# Altium schematic sheet Igul-418-T8.SchDoc: "Igul-418-T8"
size 420 x 297 mm; DrawnBy: Lazarev V; SheetNumber: 1; SheetTotal: 2; PageSetup: Record=PageOptions|CenterHorizontal=True|CenterVertical=True|PrintScale=0.75|XCorrection=1.00|YCorrection=1.00|PrintKind=0|BorderSize=5000000|LeftOffset=0|BottomOffset=0|Orientation=2|PaperLength=1000|PaperWidth=1000|Scale=100|PaperSource=260|PrintQuality=600|MediaType=1|DitherType=10|PaperKind=Letter|PrintScaleMode=1; DocumentName: Sheet1.SCHDOC
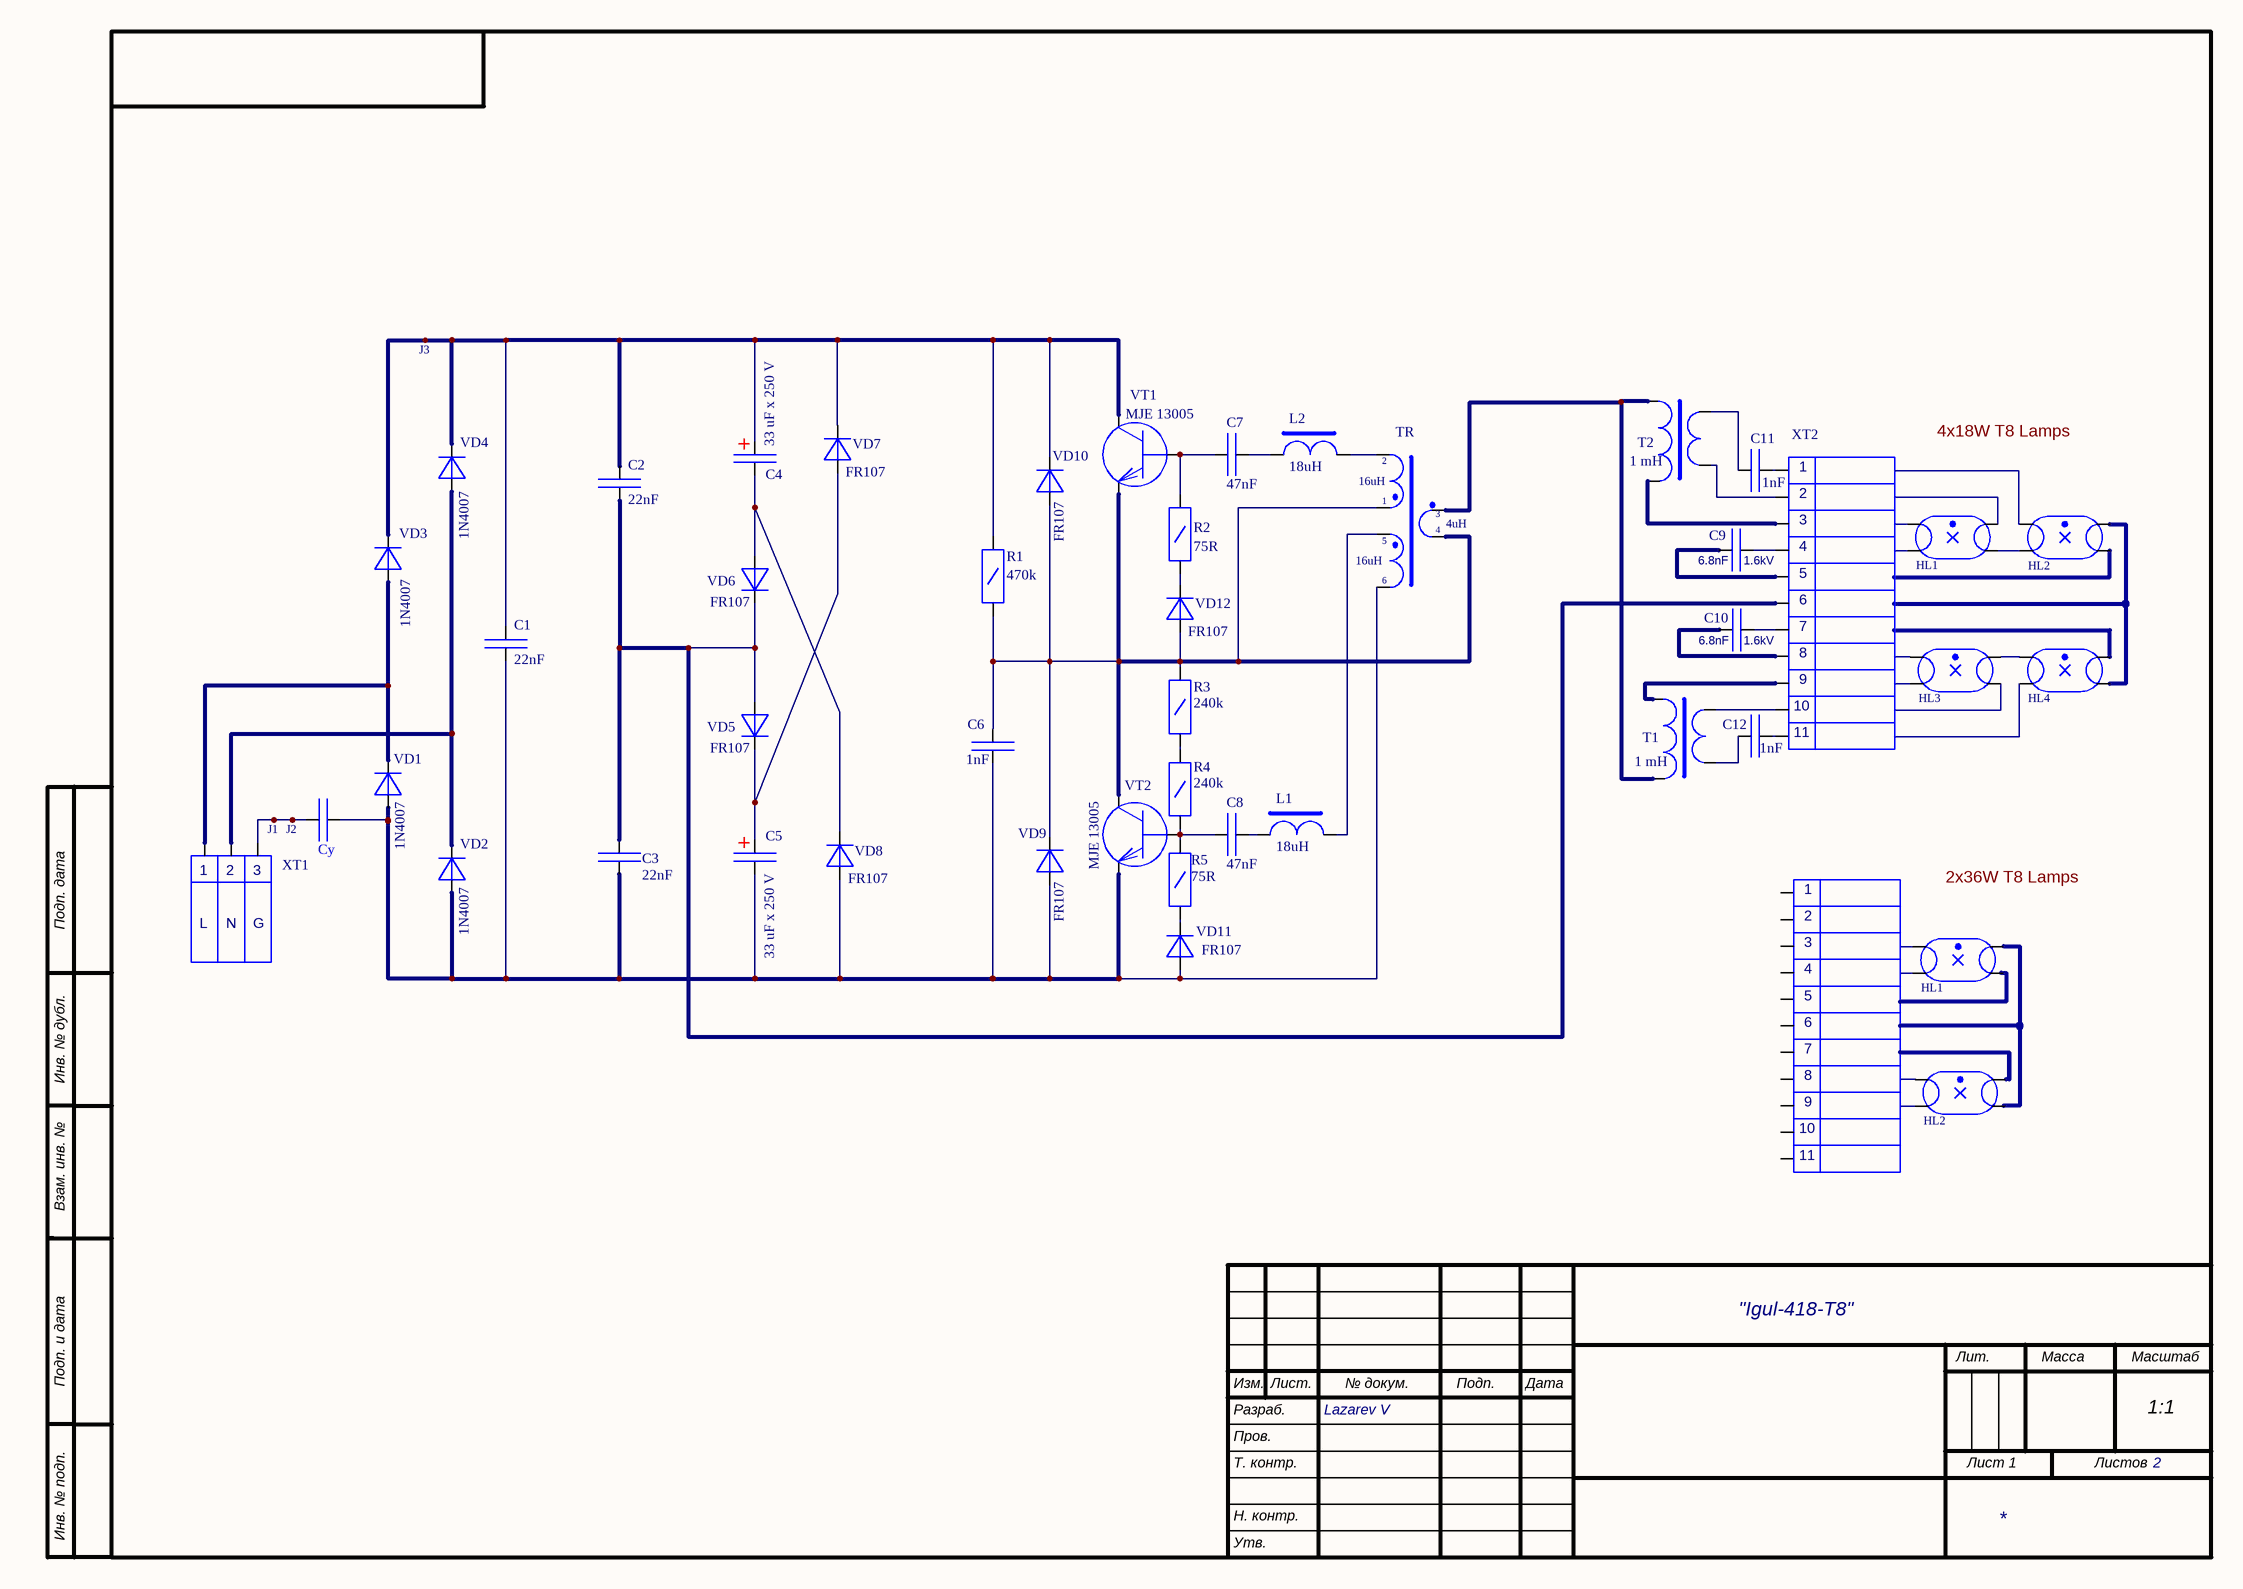
[diagram p0: Igul-418-T8.SchDoc]

## Parts
(Parts that share a designator on the sheet are numbered #1, #2 ... from top to bottom, then left to right.)
C1  value 22nF  [CAPR5.0x13.0-7.5/10]  (hidden comment: Comment)
C2  value 22nF  [CAPR5.0x13.0-7.5/10]  (hidden comment: Comment)
C3  value 22nF  [CAPR5.0x13.0-7.5/10]  (hidden comment: Comment)
C4  value 33 uF x 250 V  [CAPR E 12.5x20, pitch 5mm]  (hidden comment: 33mkF)
C5  value 33 uF x 250 V  [CAPR E 12.5x20, pitch 5mm]  (hidden comment: 33mkF)
C6  value 1nF  [CAPR5.0x13.0-5.0]  (hidden comment: Comment)
C7  value 47nF  [CAPR5.0x2.5-5.0 P. Disk]  (hidden comment: Comment)
C8  value 47nF  [CAPR5.0x2.5-5.0 P. Disk]  (hidden comment: Comment)
C9  value 6.8nF  Voltage: 1.6kV  [CAPR5.0x13.0-7.5]  (hidden comment: Comment)
C10  value 6.8nF  Voltage: 1.6kV  [CAPR5.0x13.0-7.5]  (hidden comment: Comment)
C11  value 1nF  [CAPR5.0x13.0-5.0]  (hidden comment: Comment)
C12  value 1nF  [CAPR5.0x13.0-5.0]  (hidden comment: Comment)
Cy  Comment  [CAPR Y - 7.5]  (value not drawn)
HL1#1  Lamp Lum  (value not drawn)  (graphical)
HL1#2  Lamp Lum  (value not drawn)  (graphical)
HL2#1  Lamp Lum  (value not drawn)  (graphical)
HL2#2  Lamp Lum  (value not drawn)  (graphical)
HL3  Lamp Lum  (value not drawn)  (graphical)
HL4  Lamp Lum  (value not drawn)  (graphical)
J1  Comment  [AXIAL- Jumper_9.5mm]  (value not drawn)  (net tie, no BOM)
J2  Comment  [AXIAL- Jumper_9.5mm]  (value not drawn)  (net tie, no BOM)
J3  Comment  [AXIAL- Jumper_9.5mm]  (value not drawn)  (net tie, no BOM)
L1  value 18uH  [AXIAL Inductor - 0.4]  (hidden comment: Comment)
L2  value 18uH  [AXIAL Inductor - 0.4]  (hidden comment: Comment)
R1  value 470k  [RES10.0-1/4W-470k]  (hidden comment: Comment)
R2  value 75R  [RESC3216(1206)N]  (hidden comment: Comment)
R3  value 240k  [RESC3216(1206)N]  (hidden comment: Comment)
R4  value 240k  [RESC3216(1206)N]  (hidden comment: Comment)
R5  value 75R  [RESC3216(1206)N]  (hidden comment: Comment)
T1  Value2: 1 mH  [TKM-E20-1mH-1gH]  (hidden comment: TKM-E20-1mH-1gH)
T2  Value2: 1 mH  [TKM-E20-1mH-1gH]  (hidden comment: TKM-E20-1mH-1gH)
TR  Comment  [TKM-TR9-16uH]  (value not drawn)
VD1  value 1N4007  [CD4532-1812 (mod)]
VD2  value 1N4007  [CD4532-1812 (mod)]
VD3  value 1N4007  [CD4532-1812 (mod)]  (hidden comment: Diode HS1x)
VD4  value 1N4007  [CD4532-1812 (mod)]
VD5  value FR107  [DIODE-0.4]
VD6  value FR107  [DIODE-0.4]
VD7  value FR107  [DIODE-0.4]
VD8  value FR107  [DIODE-0.4]
VD9  value FR107  [DIODE-0.4]
VD10  value FR107  [DIODE-0.4]
VD11  value FR107  [DIODE-0.4 - TKM_SILK]  (hidden comment: Comment)
VD12  value FR107  [DIODE-0.4 - TKM_SILK]  (hidden comment: Comment)
VT1  value MJE 13005  [TO-220-AB]
VT2  value MJE 13005  [TO-220-AB]
XT1  Connect x3  [ZIP-Ballast3]  (value not drawn)
XT2  Comment  [ZIP-Ballast11]  (value not drawn)
XT?  Connect x11  [ZIP-Ballast11]  (value not drawn)  (graphical)

## Nets
NetC1_1: C1.1 C2.1 C4.1 J3.1(W*) R1.2 VD3.2 VD4.2 VD7.2 VD10.2 VT1.2(C)
NetC1_2: C1.2 C3.1 C5.2 C6.1 Cy.2 TR.6(Sec2+) VD1.1 VD2.1 VD8.1 VD9.1 VD11.1 VT2.3(E)
NetC2_2: C2.2 C3.2 VD5.1 VD6.2 XT2.6(6a)
NetC4_2: C4.2 VD6.1 VD8.2
NetC5_1: C5.1 VD5.2 VD7.1
NetC6_2: C6.2 R1.1 R3.1 TR.1(Sec1-) TR.4(Pri+) VD9.2 VD10.1 VD12.1 VT1.3(E) VT2.2(C)
NetC7_1: C7.1 R2.1 VT1.1(B)
NetC7_2: C7.2 L2.1(Pri+)
NetC8_1: C8.1 R4.2 R5.1 VT2.1(B)
NetC8_2: C8.2 L1.1(Pri+)
NetC9_1: C9.1 XT2.7(7a)
NetC9_2: C9.2 XT2.8(8a)
NetC10_1: C10.1 XT2.4(4a)
NetC10_2: C10.2 XT2.5(5a)
NetC11_1: C11.1 XT2.11(11a)
NetC11_2: C11.2 T2.8(Sec+)
NetC12_1: C12.1 XT2.1(1a)
NetC12_2: C12.2 T1.1(Sec-)
NetCy_1: Cy.1 J1.1(W*) J2.1(W*) XT1.3
NetL1_2: L1.2(Pri-) TR.5(Sec2-)
NetL2_2: L2.2(Pri-) TR.2(Sec1+)
NetR2_2: R2.2 VD12.2
NetR3_2: R3.2 R4.1
NetR5_2: R5.2 VD11.2
NetT1_4: T1.4(Pri+) XT2.3(3a)
NetT1_6: T1.6(Pri-) T2.4(Pri+) TR.3(Pri-)
NetT1_8: T1.8(Sec+) XT2.2(2a)
NetT2_1: T2.1(Sec-) XT2.10(10a)
NetT2_6: T2.6(Pri-) XT2.9(9a)
NetVD1_2: VD1.2 VD3.1 XT1.1
NetVD2_2: VD2.2 VD4.1 XT1.2

Not connected (* = marked no-connect by the designer): HL1#1 1 2 3 4; HL1#2 1 2 3 4; HL2#1 1 2 3 4; HL2#2 1 2 3 4; HL3 1 2 3 4; HL4 1 2 3 4; XT? 1(1a) 2(2a) 3(3a) 4(4a) 5(5a) 6(6a) 7(7a) 8(8a) 9(9a) 10(10a) 11(11a)

## Notes on the sheet
- 4x18W T8 Lamps
- (near TR) 16uH
- (near TR) 4uH
- (near XT2) 1
- (near XT2) 2
- (near XT2) 3
- (near XT2) 4
- (near XT2) 5
- (near XT2) 6
- (near XT2) 7
- (near XT2) 8
- (near XT2) 10
- (near XT2) 9
- (near XT2) 11
- (near XT1) 1
- L
- (near XT1) 2
- N
- (near XT1) 3
- G
- (near XT?) 1
- (near XT?) 2
- 2x36W T8 Lamps
- (near XT?) 3
- (near XT?) 4
- (near XT?) 5
- (near XT?) 6
- (near XT?) 7
- (near XT?) 10
- (near XT?) 8
- (near XT?) 9
- (near XT?) 11
- Подп. дата
- Инв. № дубл.
- Взам. инв. №
- Подп. и дата
- Изм.
- Лист.
- № докум.
- Подп.
- Дата
- Лит.
- Масса
- Масштаб
- Разраб.
- Пров.
- Т. контр.
- Лист 1
- Листов
- 1:1
- Инв. № подп.
- Н. контр.
- Утв.

## Library data of the parts
C1-C3 = Cap1: Capacitor GOST; Voltage: 630VDC; Tolerance: 10 %; Dielectrik: Polypropyline/Ceramic; PackageDescription: Radial Capacitor; Package Reference: Capacitor Thru-Hole, Pin Spacing 10.0 mm; Function: *; Part Number: *; Supplier: *; Supplier Part Number: *
C4 C5 = Cap Pol: Cap Pol GOST; Function: PFC Capacitor; PackageDescription: Radial Electrolytic Capacitor 13.0x21.0mm Pitch 5.0mm; Package Reference: *
C6 C11 C12 = Cap1: Capacitor GOST; Voltage: 1kV; Tolerance: 10 %; Dielectrik: Polypropyline/Ceramic; PackageDescription: Radial Capacitor; Package Reference: Capacitor Thru-Hole Disk Body Pin Spacing 5.0 mm; Function: *; Part Number: *; Supplier: *; Supplier Part Number: *
C7 C8 = Cap_SMD: Ceramic; Voltage: 50V; Tolerance %: 10%; PackageDescription: Capr.Ceramic Disk,Thru-Hole Body 5.0 x 2.5 mm (WxT) Pin Spacing 5.0 mm.; Function: *; Supplier: *; Supplier Part Number: *; Dielectric: Ceramic
C9 C10 = Cap1: Capacitor GOST; Tolerance: 10 %; Dielectrik: Polypropyline/Ceramic; Voltage Type: VDC; PackageDescription: Radial Capacitor; Package Reference: Capacitor Thru-Hole, Pin Spacing 10.0 mm; Function: *; Part Number: *; Supplier: *; Supplier Part Number: *
Cy = Cap1: Capacitor GOST; Part Number: MKY22W12203D00; Voltage: 275 VAC; Function: Y-Cap; Value: 2.2 nF; Tolerance: 5 %; Dielectrik: MKP-Y2; PackageDescription: Radial Capacitor; Package Reference: *
HL1#1 HL1#2 HL2#1 HL2#2 HL3 HL4 = Lamp Lum: Lamp Lum GOST; Value: *
J1-J3 = Jumper_1: Jumper Wire; PackageDescription: Radial Cap, Thru-Hole; 2 Leads; 0.2 in Pin Spacing
L1 L2 = Choke Axial: Axial 1/4W; Function: Choke; PackageDescription: Axial 1/4W; Pitch 400 mil
R1-R5 = Res 1/4W: Resistor GOST; Tolerance: 5%; PackageReference: *; Function: *; Part Number: *
  R1: PackageDescription: Axial Resistor, Pitch 10.0mm, 1/4W
  R2-R5: PackageDescription: Axial Resistor 1/4W, Pitch 10.2mm
T1 T2 = Choke Ballast-TKM-E20-1mH-1gF: E20/10/6; Function: Choke Ballast; PackageDescription: E20/10/6; Value: TKM-E20-1mH-1gH
TR = Trans TR-TKM: Trans TR GOST; Value: TKM-TR9-16uH; Function: *; PackageDescription: TR9
VD1-VD4 = Diode1: Diode GOST; Function: Rectifier diode; Part Number: *; PackageDescription: Chip Diode; Body 4.5 x 3.2 mm (LxW typ); PackageReference: *
VD5-VD12 = Diode HS1x: Diode HS1x (GOST); Function: Fast Rectifier Diode; Package Description: Axial Diode, Pitch 10.0 mm; Part Number: *
VT1 VT2 = MJE13007: NPN_TO-220; Functioun: Hight Voltage Switch; PackageDescription: Thru Hole; PackageReference: TO-220; Part Number: *
  VT1: Value2: MJE 13007
  VT2: Value2: MJE 13005
XT1 = Connect x3: Connect x3 GOST
XT2 XT? = Connect x11: Connect x11 GOST